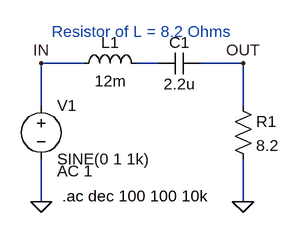
[diagram p0: schematic 2-2-1_RLC_series.asc]
2-2-1_RLC_series.asc, the LTspice schematic file:
Version 4.1
SHEET 1 880 680
WIRE 160 64 96 64
WIRE 272 64 240 64
WIRE 400 64 336 64
WIRE 96 128 96 64
WIRE 400 128 400 64
WIRE 96 272 96 208
WIRE 400 272 400 208
FLAG 96 272 0
FLAG 400 272 0
FLAG 400 64 OUT
FLAG 96 64 IN
SYMBOL voltage 96 112 R0
WINDOW 123 24 114 Left 2
WINDOW 39 0 0 Left 0
SYMATTR Value2 AC 1
SYMATTR InstName V1
SYMATTR Value SINE(0 1 1k)
SYMBOL res 384 112 R0
SYMATTR InstName R1
SYMATTR Value 8.2
SYMBOL ind 144 80 R270
WINDOW 0 32 56 VTop 2
WINDOW 3 5 56 VBottom 2
SYMATTR InstName L1
SYMATTR Value 12m
SYMATTR SpiceLine Rser=8.2
SYMBOL cap 336 48 R90
WINDOW 0 0 32 VBottom 2
WINDOW 3 32 32 VTop 2
SYMATTR InstName C1
SYMATTR Value 2.2u
TEXT 112 16 Left 2 ;Resistor of L = 8.2 Ohms
TEXT 128 264 Left 2 !.ac dec 100 100 10k

The netlist it stands for:
* 2-2-1_RLC_series.asc
V1 IN 0 SINE(0 1 1k) AC 1
R1 OUT 0 8.2
L1 IN N001 12m Rser=8.2
C1 OUT N001 2.2u
* Resistor of L = 8.2 Ohms
.ac dec 100 100 10k
.backanno
.end